# Altium schematic sheet MCU.SchDoc
size A4
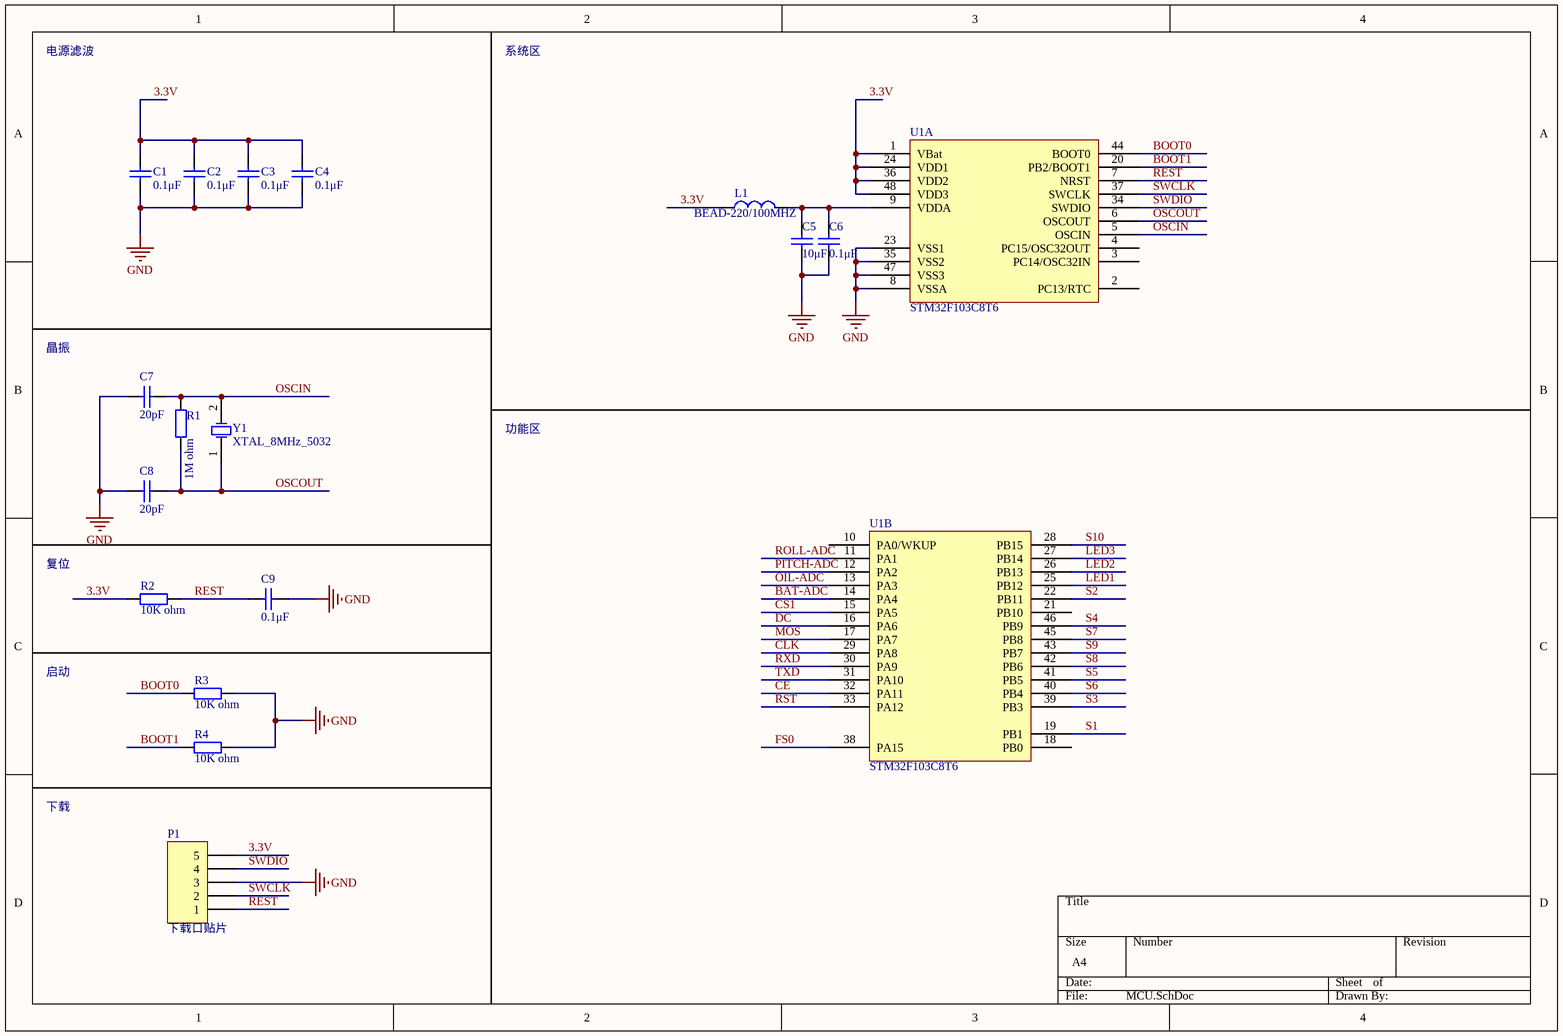
[diagram p0: MCU.SchDoc]

## Parts
C1  0.1μF  [0603C]
C2  0.1μF  [0603C]
C3  0.1μF  [0603C]
C4  0.1μF  [0603C]
C5  10μF  [0603C]
C6  0.1μF  [0603C]
C7  20pF  [0603C]
C8  20pF  [0603C]
C9  0.1μF  [0603C]
L1  BEAD-220/100MHZ  [0603R]
P1  下载口贴片  [HDR1X5 - danceng]
R1  1M ohm  [0603R]
R2  10K ohm  [0603R]
R3  10K ohm  [0603R]
R4  10K ohm  [0603R]
U1  STM32F103C8T6  [LQFP48]  (parts A,B of 2)
Y1  XTAL_8MHz_5032  [5032]

## Nets
GND: C1.1 C2.1 C3.1 C4.1 C5.1 C6.1 C7.2 C8.2 C9.1 P1.3 R3.2 R4.2 U1.8(VSSA) U1.23(VSS1) U1.35(VSS2) U1.47(VSS3)
3.3V: C1.2 C2.2 C3.2 C4.2 L1.1 P1.5 R2.1 U1.1(VBat) U1.24(VDD1) U1.36(VDD2) U1.48(VDD3)
BAT-ADC: U1.14(PA4)
BOOT0: R3.1 U1.44(BOOT0)
BOOT1: R4.1 U1.20(PB2/BOOT1)
CE: U1.32(PA11)
CLK: U1.29(PA8)
CS1: U1.15(PA5)
DC: U1.16(PA6)
FS0: U1.38(PA15)
LED1: U1.25(PB12)
LED2: U1.26(PB13)
LED3: U1.27(PB14)
MOS: U1.17(PA7)
OIL-ADC: U1.13(PA3)
OSCIN: C7.1 R1.2 U1.5(OSCIN) Y1.2(OSC2)
OSCOUT: C8.1 R1.1 U1.6(OSCOUT) Y1.1(OSC1)
PITCH-ADC: U1.12(PA2)
REST: C9.2 P1.1 R2.2 U1.7(NRST)
ROLL-ADC: U1.11(PA1)
RST: U1.33(PA12)
RXD: U1.30(PA9)
S1: U1.19(PB1)
S2: U1.22(PB11)
S3: U1.39(PB3)
S4: U1.46(PB9)
S5: U1.41(PB5)
S6: U1.40(PB4)
S7: U1.45(PB8)
S8: U1.42(PB6)
S9: U1.43(PB7)
S10: U1.28(PB15)
SWCLK: P1.2 U1.37(SWCLK)
SWDIO: P1.4 U1.34(SWDIO)
TXD: U1.31(PA10)
NetC5_2: C5.2 C6.2 L1.2 U1.9(VDDA)

Not connected (* = marked no-connect by the designer): U1 2(PC13/RTC) 3(PC14/OSC32IN) 4(PC15/OSC32OUT) 10(PA0/WKUP) 18(PB0) 21(PB10)

## Notes on the sheet
- 电源滤波
- 系统区
- 晶振
- 功能区
- 复位
- 启动
- 下载

## Library data of the parts
C1-C4 C6 C9 = Cap_0.1μF_50V_0603: 0.1μF_50V,X7R,±5%; 物料名称: 贴片陶瓷电容; 制造商: muRata; 物料编码: TCC0087; 物料型号: GRM188R71H104JA93D; 单位: PCS; 物料规格: 0.1μF_50V,X7R,±5%
C5 = Cap_10μF_35V_0603: 10μF_35V,X5R,20%; 物料规格: 10μF_35V,20%; 物料名称: 贴片陶瓷电容; 制造商: muRata; 物料编码: TCC0071; 物料型号: GRM188R6YA106MA73D; 单位: PCS
C7 C8 = Cap_20pF_50V_0603: 20pF_50V,CH,±5%; 物料名称: 贴片陶瓷电容; 制造商: muRata; 物料编码: TCC0036; 物料型号: GRM1882C1H200JA01D; 单位: PCS; 物料规格: 20pF_50V,CH,±5%
L1 = BEAD-220/100MHZ_0603: 物料名称: 磁珠; 制造商: TDK; 物料编码: TCZ0006; 物料型号: MMZ1608B221CTAH0; 单位: PCS; 物料规格: BEAD-220/100MHZ
P1 = DAP下载口贴片: 制造商: NA; 单位: PCS; 物料规格: DAP下载口贴片; 物料名称: DAP下载口贴片; 物料编码: NA; 物料型号: DAP下载口贴片
R1 = Res_1M ohm_0603: 1M ohm,1%; 物料名称: 贴片电阻; 制造商: YAGEO; 物料编码: TRS0067; 物料型号: RC0603FR-071ML; 单位: PCS; 物料规格: 1M ohm,1%
R2-R4 = Res_10K ohm_0603: 10K ohm,1%; 物料名称: 贴片电阻; 制造商: YAGEO; 物料编码: TRS0020; 物料型号: RC0603FR-0710KL; 单位: PCS; 物料规格: 10K ohm,1%
U1 = STM32F103C8T6: 物料名称: 单片机; 制造商: ST; 物料编码: TIC0036; 单位: PCS; 物料规格: STM32F103C8T6; 物料型号: STM32F103C8T6
Y1 = XTAL_8MHz_5032: XTAL_8MHz; 物料规格: 8MHz; 物料名称: 晶振; 制造商: TAITIEN; 物料编码: NA; 物料型号: XIHCCCNANF-8.000; 单位: PCS